# Altium schematic sheet PCB_Oven_Sch.SchDoc
size A4
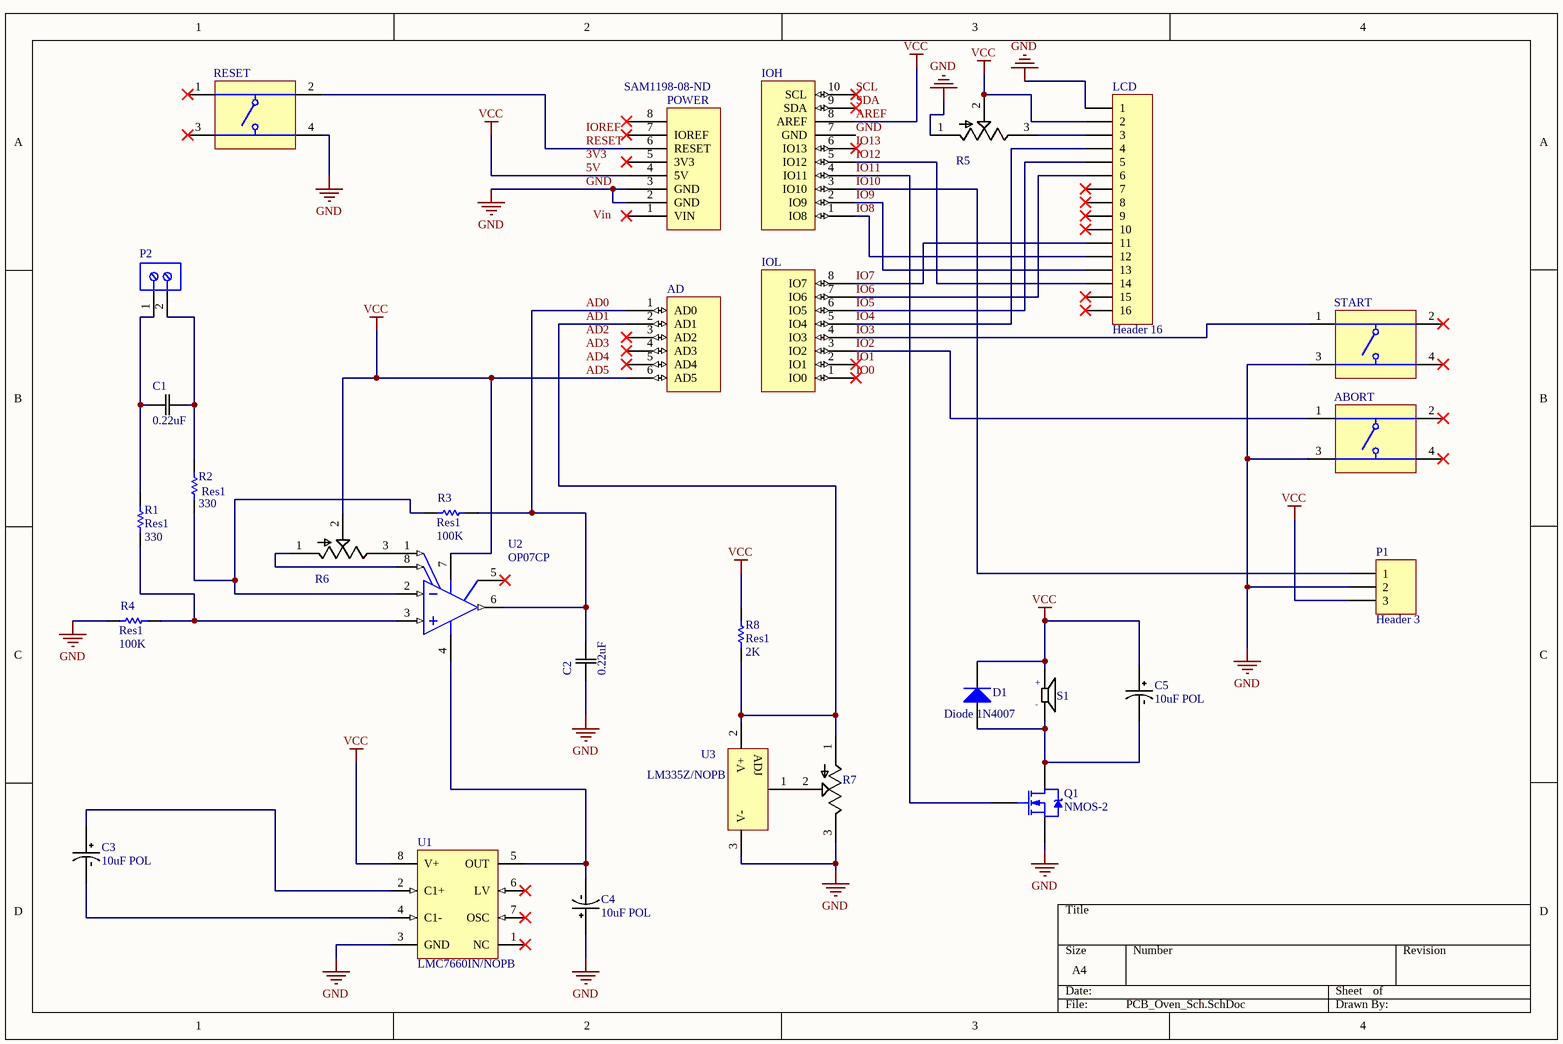
[diagram p0: PCB_Oven_Sch.SchDoc]

## Parts
ABORT  1825910-6  [TECO-1825910-6_V]  (value not drawn)
AD  AD  [Header 6x1 8.5mm]  (value not drawn)
C1  0.22uF  [0.22uF Thru hole]
C2  0.22uF  [0.22uF Thru hole]
C3  10uF POL  [CAP POL 10uF THRU]
C4  10uF POL  [CAP POL 10uF THRU]
C5  10uF POL  [CAP POL 10uF THRU]
D1  Diode 1N4007  [DO-41]
IOH  IOH  [Header 10x1 8.5mm]  (value not drawn)
IOL  IOL  [Header 8x1 8.5mm]  (value not drawn)
LCD  Header 16  [HDR1X16]
P1  Header 3  [HDR1X3]
P2  282836-2  [TECO-282836-2_V]  (value not drawn)
POWER  Supplier Part Number 1: SAM1198-08-ND  [Header 8x1 8.5mm]  (hidden comment: POWER_UNO)
Q1  NMOS-2  [TO-220AB]
R1  Res1  value 330  [AXIAL-0.3]
R2  Res1  value 330  [AXIAL-0.3]
R3  Res1  value 100K  [AXIAL-0.3]
R4  Res1  value 100K  [AXIAL-0.3]
R5  20K  [Potentiometer 20K]  (value not drawn)
R6  20K  [Potentiometer 20K]  (value not drawn)
R7  20K  [Potentiometer 20K]  (value not drawn)
R8  Res1  value 2K  [AXIAL-0.3]
RESET  1825910-6  [TECO-1825910-6_V]  (value not drawn)
S1  CEM-1203(42) THRU  [CEM-1203]  (value not drawn)
START  1825910-6  [TECO-1825910-6_V]  (value not drawn)
U1  LMC7660IN/NOPB  [P0008A]
U2  OP07CP  [P0008A]
U3  LM335Z/NOPB  [LP0003A]

## Nets
5V: AD.6(AD5) C5.POS D1.2(K) IOH.8(AREF) LCD.2 P1.3 POWER.4(5V) R5.2(WIPER) R6.2(WIPER) R8.1 S1.P U1.8(V+) U2.7(VCC+)  [also labelled AD5, AREF, VCC]
GND: ABORT.3 C2.1(C1) C4.POS IOH.7(GND) LCD.1 P1.2 POWER.2(GND) POWER.3(GND) Q1.3(S) R4.2 R5.1(CCW) R7.3(CW) RESET.4 START.3 U1.3(GND) U3.3(V-)
AD0: AD.1(AD0) C2.2(C2) R3.1 U2.6(OUT)
AD1: AD.2(AD1) R7.1(CCW) R8.2 U3.2(V+)
IO0: IOL.1(IO0)
IO1: IOL.2(IO1)
IO2: ABORT.1 IOL.3(IO2)
IO3: IOL.4(IO3) START.1
IO4: IOL.5(IO4) LCD.4
IO5: IOL.6(IO5) LCD.5
IO6: IOL.7(IO6) LCD.6
IO7: IOL.8(IO7) LCD.11
IO8: IOH.1(IO8) LCD.12
IO9: IOH.2(IO9) LCD.13
IO10: IOH.3(IO10) P1.1
IO11: IOH.4(IO11) Q1.1(G)
IO12: IOH.5(IO12) LCD.14
IO13: IOH.6(IO13)
RESET: POWER.6(RESET) RESET.2
SCL: IOH.10(SCL)
SDA: IOH.9(SDA)
NetC1_1: C1.1(C1) P2.1 R1.2
NetC1_2: C1.2(C2) P2.2 R2.2
NetC3_NEG: C3.NEG U1.4(C1-)
NetC3_POS: C3.POS U1.2(C1+)
NetC4_NEG: C4.NEG U1.5(OUT) U2.4(VCC-)
NetC5_NEG: C5.NEG D1.1(A) Q1.2(D) S1.N
NetLCD_3: LCD.3 R5.3(CW)
NetR1_1: R1.1 R4.1 U2.3(IN+)
NetR2_1: R2.1 R3.2 U2.2(IN-)
NetR6_1: R6.1(CCW) U2.8(OFFSET_N2)
NetR6_3: R6.3(CW) U2.1(OFFSET_N1)
NetR7_2: R7.2(WIPER) U3.1(ADJ)

Not connected (* = marked no-connect by the designer): ABORT 2* 4*; AD 3(AD2)* 4(AD3)* 5(AD4)*; LCD 7* 8* 9* 10* 15* 16*; POWER 1(VIN)* 5(3V3)* 7(IOREF)* 8*; RESET 1* 3*; START 2* 4*; U1 1(NC)* 6(LV)* 7(OSC)*; U2 5(NC)*

## Notes on the sheet
- Labels drawn without touching a wire or pin: 3V3, AD2, AD3, AD4, IOREF, Vin
- (in symbol CEM-1203(42) THRU) +; -

## Library data of the parts
ABORT RESET START = CMP-1684-00021-1: Tact Switch, SPST-NO, 0.05 A, -35 to 85 degC, 4-Pin THD, RoHS, Bulk; Manufacturer: TE Connectivity; Maximum Contact Resistance: 100mOhm; Mechanical Life: 100000Cycles; Bushing Type: Unthreaded; Switch Configuration: OFF(ON); Maximum DC Voltage Rating: 24V; Contact Rating @ Voltage: 0.05A@24VDC; Actuator Color: Black; Body Orientation: Straight; Function: MomentaryContact; Illumination: N/R; Actuator Style: RoundButton; Actuator Material: PolybutyleneTerephthalate; Dielectric Strength: 500VAC; Pole Throw Configuration: SPST; Actuator Length: 1.4mm; Product Weight: N/A; Contact Material: CopperAlloy; Housing Material: N/A; Terminal Type: PCPins; Minimum Insulation Resistance: 100MOhm; Package Description: 4-Pin Through Hole Device, Body 5.99 x 5.99 mm, Pitch 6.5 mm; Part No: 1825910-6; Package Reference: THD; Base Material: N/A; Manufacturer URL: http://www.te.com; Contact Plating: Silver; RoHS: Yes; Datasheet Version: Rev. C9; Electrical Life: 100000Cycles; Maximum AC Voltage Rating: N/A; Thread Size: N/R; Operating Temperature: -35to85C; Mounting: ThroughHole; Dimension: 5.99x5mm; Datasheet URL: http://www.te.com/commerce/DocumentDelivery/DDEController?Action=showdoc&DocId=Customer+Drawing%7F1825910%7FC9%7Fpdf%7FEnglish%7FENG_CD_1825910_C9.pdf%7F1825910-6; Family: 1825910; Seal Location: N/A; Seal Description: N/A; Packaging: N/A
C1 C2 = CAP 0.22uF: CAP CER 0.22UF 200V; MP: C317C221K2G5TA7301; MF: KEMET; Tolerance: 10%; Package: Through Hole Radial; Price: 0.49 CAD; Value: 0.22 uF; Digikey: 399-13974-1-ND; Digikey Link: https://www.digikey.ca/product-detail/en/kemet/C317C221K2G5TA7301/399-13974-1-ND/6562545; Rating: 200V; ComponentLink1Description: digikey; ComponentLink1URL: https://www.digikey.ca/product-detail/en/kemet/C317C221K2G5TA7301/399-13974-1-ND/6562545
C3-C5 = CAP POL 10uF THRU: CAP ALUM 10UF 20% 50V RADIAL; Usage Rating: 2000hrs @ 85C; Type: Aluminum Electrolytic; MP: ECA-1HM100I; MF: Panasonic Electronic Components; ComponentLink1Description: Digikey Link; ComponentLink1URL: https://www.digikey.ca/product-detail/en/panasonic-electronic-components/ECA-1HM100I/P10425CT-ND/8603345; Value: 10uF; Package: Through Hole Radial; Tolerance: 20%; Voltage Rating: 50V; Price: 0.31 CAD; Digikey PN: P10425CT-ND
D1 = Diode 1N4007: 1 Amp General Purpose Rectifier; Published: 8-Jun-2000; LatestRevisionDate: 17-Jul-2002; LatestRevisionNote: Re-released for DXP Platform.; DatasheetVersion: 1998; PackageVersion: Aug-1999; PackageReference: DO-41; Publisher: Altium Limited; PackageDescription: Diode, Axial; Body 5.2 x 2.7 mm (LxDia. max), Lead Dia. 0.86 mm (max); Code_JEDEC: DO-204-AL; ComponentLink1Description: Manufacturer Link; ComponentLink1URL: http://www.fairchildsemi.com/; ComponentLink2Description: Datasheet; ComponentLink2URL: http://www.fairchildsemi.com/ds/1N%2F1N4001.pdf
LCD = Header 16: Header, 16-Pin; LatestRevisionDate: 17-Jul-2002; LatestRevisionNote: Re-released for DXP Platform.; Publisher: Altium Limited
P1 = Header 3: Header, 3-Pin; LatestRevisionDate: 17-Jul-2002; LatestRevisionNote: Re-released for DXP Platform.; Publisher: Altium Limited
P2 = CMP-1684-00017-1: Female Header, Pitch 5 mm, 1 x 2 Position, Height 10 mm, Tail Length 3.5 mm, Rohs, Bulk; Manufacturer: TE Connectivity; Wire Gauge: 16-30AWG; Product Training Modules: Wire-to-BoardEurostyleTerminalBlocks; Clamp Material - Plating: Brass-NickelPlated; Voltage: 300V; Mating Orientation: HorizontalwithBoard; Current: 13.5A; Pitch: 0.197"(5.00mm); Screw Thread: M3; 3D Model: 282836-2.pdf; Other Names: 5ULV-02B / A98076; Dynamic Catalog: BuchananSeries; Number of Levels: 1; Torque - Screw: 0.68Nm(6Lb-In); Featured Product: EurostyleTerminalBlockConnectors; Positions Per Level: 2; Wire Termination: Screw-RisingCageClamp; Datasheet URL: http://www.te.com.cn/commerce/DocumentDelivery/DDEController?Action=showdoc&DocId=Catalog+Section%7F1308389_EUROSTYLE_TERMINAL_BLOCKS%7F0607%7Fpdf%7FEnglish%7FENG_CS_1308389_EUROSTYLE_TERMINAL_BLOCKS_0607.pdf%7F282836-2; Color: Green; Family: TerminalBlocks-WiretoBoard; RoHS Information: 282836-2StatementofCompliance; Standard Package: 300; Contact Material - Plating: Brass-TinPlated; Manufacturer URL: http://www.te.com; Housing Material: Polyamide(PA66),Nylon6/6; Features: Interlocking(Side); Package Description: Female Header, Pitch 5 mm, 1 x 2 Position, Height 10 mm, Tail Length 3.5 mm; Mounting Type: ThroughHole; Package Reference: THD; Packaging: Bulk; Series: Buchanan; Category: Connectors,Interconnects; Screw Material - Plating: Brass-NickelPlated
Q1 = NMOS-2: N-Channel Power MOSFET; Note: Pin 2 is electrically connected to pin 4.; Published: 8-Jun-2000; LatestRevisionDate: 17-Jul-2002; LatestRevisionNote: Re-released for DXP Platform.; DatasheetVersion: PD-9.814; PackageVersion: Feb-1997; PackageReference: TO-220AB; Publisher: Altium Limited; PackageDescription: TO, Thru-Hole, Vertical, Heatsink Mounted; 3 In-Line Leads; Pitch 2.54 mm; ComponentLink1Description: Manufacturer Link; ComponentLink1URL: http://www.irf.com/
R1-R4 R8 = Res1: Resistor; Published: 8-Jun-2000; LatestRevisionDate: 17-Jul-2002; LatestRevisionNote: Re-released for DXP Platform.; PackageReference: AXIAL-0.3; Publisher: Altium Limited; PackageDescription: Axial Device, Thru-Hole; 2 Leads; 0.3 in Pin Spacing
R5-R7 = POT 20K THRU: TRIMMER 20K OHM 0.5W PC PIN TOP - Phillips Screw head; MF: Bourns Inc.; MP: 3362P-1-203RLF; ComponentLink1Description: Digikey Link; ComponentLink1URL: https://www.digikey.ca/product-detail/en/bourns-inc/3362P-1-203RLF/3362P-1-203RLFCT-ND/3767981; Digikey: 3362P-1-203RLF; Package: Through Hole; Price: 3.05 CAD; ComponentLink2Description: SnapEDA Link (205, since 203 DNE); ComponentLink2URL: https://www.snapeda.com/parts/3362P-1-205LF/Bourns%20-%20J.W.%20Miller/view-part/463695/
S1 = CEM-1203(42) THRU: 35mA 2.048kHz 85dB @ 3.5V; MF: CUI Devices; Current Rating: 35 mA @ 3.5 V; Rated Voltage: 3-5 V; Frequency: 2.048 kHz @ 3.5 V; ComponentLink1Description: Digikey Link; ComponentLink1URL: https://www.digikey.ca/products/en?keywords=CEM%201203%20buzzer; ComponentLink2Description: SnapEDA Link; ComponentLink2URL: https://www.snapeda.com/parts/CEM-1203%2842%29/CUI%20Devices/view-part/?ref=search&t=CEM%201203; Digikey PN: 102-1153-ND; MP: CEM-1203(42); Decibels: 85 dB @ 3.5 V; Price: 1.13 CAD
U1 = CMP-0065-00002-3: Switched Capacitor Voltage Converter, 8-pin MDIP, Pb-Free; Manufacturer: Texas Instruments; PackageTopMarking: NSUZXYTTE#*LMC*7660IN; CompType: Switch Caps; PowerWise: N; Code_JEDEC: MS-001-BA; RoHS: Y; ComponentLink1Description: Datasheet URL; ComponentLink1URL: http://www.ti.com/general/docs/lit/getliterature.tsp?genericPartNumber=LMC7660&fileType=pdf; PinCount: 8; PackageReference: P0008A; PackageDescription: MDIP, .365 x .250 x .130in, 8 Lead, .100in Pitch
U2 = CMP-0017-00916-2: Low-Offset Voltage Operational Amplifier, 6 to 36 V, 0 to 70 degC, 8-pin DIP (P8), Pb-Free (RoHS); Manufacturer: Texas Instruments; Rating: Catalog; Iq per channel(Max)(mA): 5; GBW(Typ)(MHz): 0.6; Vn at 1kHz(Typ)(nV/rtHz): 9.8; Number of Channels: 1; Total Supply Voltage(Min)(+5V is 5, +/-5V is 10): 6; Vio (25C)(Max)(mV): 0.15; Slew Rate(Typ)(V/us): 0.3; Sub Family: General Purpose Amplifier, High Supply Voltage Amplifier (>=30V), Low Noise Amp (<=10nV/rtHz), Low Offset Voltage Amplifier (<=500uV); IIB(Max)(pA): 7000; Total Supply Voltage(Max)(+5V is 5, +/-5V is 10): 36; Offset Drift(Typ)(uV/C): 0.5; CMRR(Min)(dB): 100; Code_JEDEC: MS-001; ComponentLink1URL: http://www.ti.com/; ComponentLink2URL: http://www.ti.com/lit/ds/symlink/op07c.pdf; ComponentLink3Description: Package Specification; DatasheetVersion: SLOS099E; ComponentLink2Description: Datasheet; Eco-Plan: Pb-Free (RoHS); Mounting Technology: Through Hole; PackageReference: P0008A; PartNumber: OP07CP; ComponentLink3URL: http://www.ti.com/litv/pdf/mpdi001b; PackageVersion: 4040082/E, 04/2010; ComponentLink1Description: Manufacturer URL; PackageDescription: 8-Pin Plastic In-Line, Body 9.59 x 6.35 mm, Pitch 2.54 mm
U3 = CMP-0066-00016-3: Precision Temperature Sensor, 3-pin TO-92, Pb-Free; Manufacturer: Texas Instruments; PowerWise: N; PackageTopMarking: NSXYTT*LM335*Z; CompType: Temp Sensor IC; RoHS: Y; PinCount: 3; PackageDescription: TO-92, Molded, 3 Lead; ComponentLink1URL: http://www.ti.com/general/docs/lit/getliterature.tsp?genericPartNumber=LM335&fileType=pdf; Code_JEDEC: TO-226-AA; ComponentLink1Description: Datasheet URL; PackageReference: LP0003A
AD = AD: Supplier 1: Arrow; Supplier Part Number 1: 2699089; Supplier 2: Digi-Key; Supplier Part Number 2: SAM1198-06-ND; Supplier 3: Arrow; Supplier Part Number 3: 2699088; Supplier 4: Arrow; Supplier Part Number 4: 2699075
IOH = IOH: Supplier 1: Arrow; Supplier Part Number 1: 2698803S4475693N1004; Supplier 2: Digi-Key; Supplier Part Number 2: SAM1198-10-ND; Supplier 3: Arrow; Supplier Part Number 3: 2698789
IOL = IOL: Supplier 1: Digi-Key; Supplier Part Number 1: SAM1198-08-ND; Supplier 2: Arrow; Supplier Part Number 2: 2698939; Supplier 3: Arrow; Supplier Part Number 3: 2698940; Supplier 4: Arrow; Supplier Part Number 4: 2698925
POWER = POWER_UNO: Supplier 1: Digi-Key; Supplier 2: Arrow; Supplier Part Number 2: 2698940; Supplier 3: Arrow; Supplier Part Number 3: 2698925; Supplier 4: Arrow; Supplier Part Number 4: 2698939